# EAGLE schematic intech-senpai-camion-grue-complet (EAGLE 8.6.0)

## Sheet 1 of 3
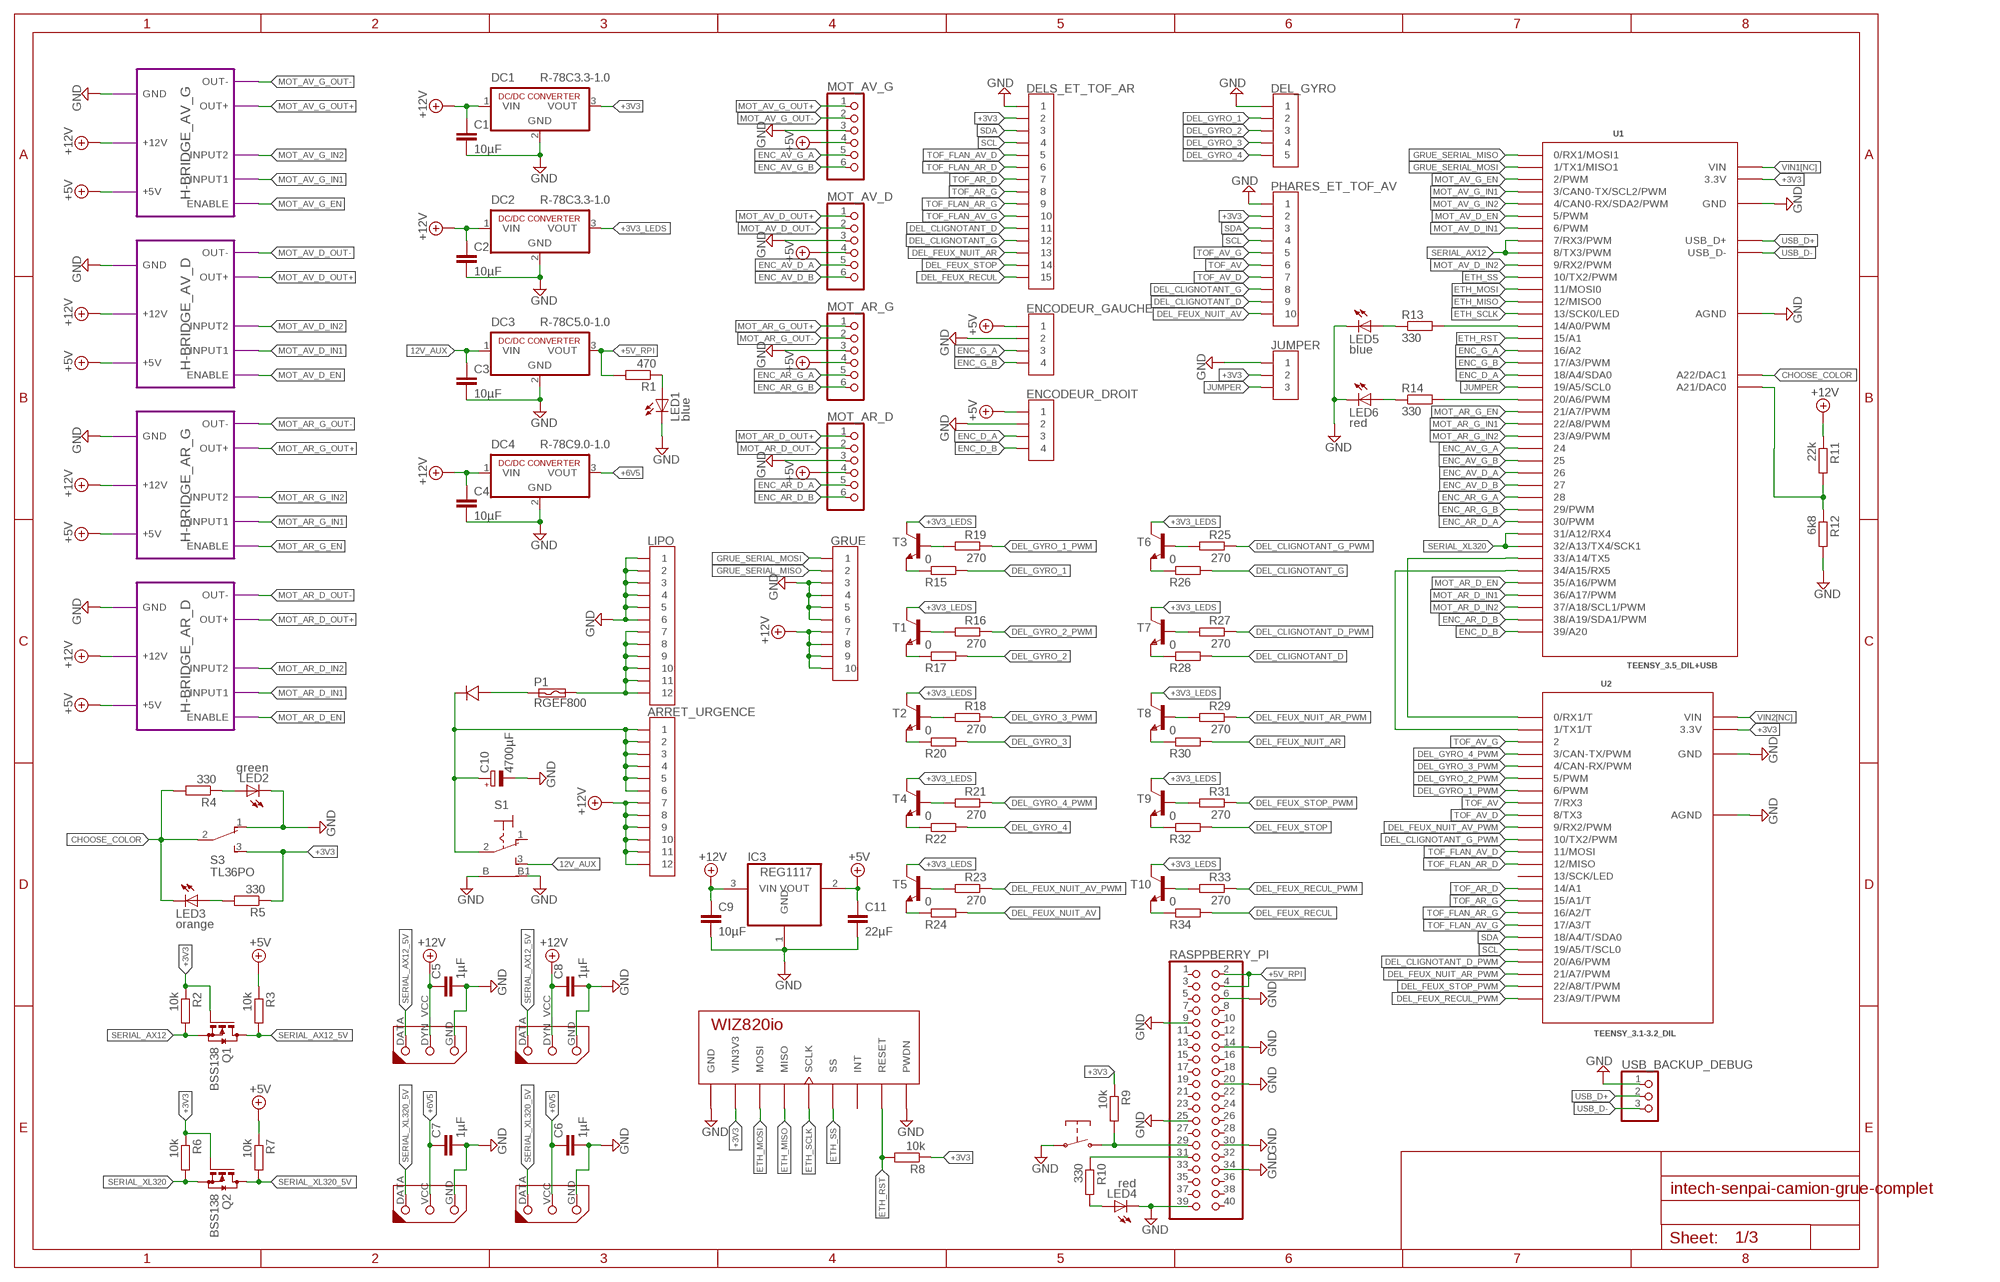
[diagram p0: schematic, sheet 1]

### Parts
ARRET_URGENCE  JST-12  [GH-12-V]
AX12_D  DYNAMIXEL-1X03AX  [DYNAMIXEL_AX_1X03]
AX12_G  DYNAMIXEL-1X03AX  [DYNAMIXEL_AX_1X03]
C1  10µF  C-EUC0805  [C0805]
C2  10µF  C-EUC0805  [C0805]
C3  10µF  C-EUC0805  [C0805]
C4  10µF  C-EUC0805  [C0805]
C5  1µF  C-EUC0805  [C0805]
C6  1µF  C-EUC0805  [C0805]
C7  1µF  C-EUC0805  [C0805]
C8  1µF  C-EUC0805  [C0805]
C9  10µF  C-EUC0805  [C0805]
C10  4700µF  CPOL-EUTT5D11L  [TT5D11L]
C11  22µF  C-EUC0805  [C0805]
D1  DIODE_S15P45  [TO-277A]
DC1  R-78C3.3-1.0  [SIP3]
DC2  R-78C3.3-1.0  [SIP3]
DC3  R-78C5.0-1.0  [SIP3]
DC4  R-78C9.0-1.0  [SIP3]
DEL_GYRO  JST-05  [GH-05-V]
DELS_ET_TOF_AR  JST-15  [GH-15-V]
ENCODEUR_DROIT  JST-04GH-V  [GH-04-V]
ENCODEUR_GAUCHE  JST-04GH-V  [GH-04-V]
GRUE  JST-10  [GH-10-V]
IC3  REG1117  [SOT223]
JUMPER  JST-03  [GH-03-V]
LED1  blue  LEDSMT1206  [1206]
LED2  green  LEDSMT1206  [1206]
LED3  orange  LEDSMT1206  [1206]
LED4  red  LEDSMT1206  [1206]
LED5  blue  LEDSMT1206  [1206]
LED6  red  LEDSMT1206  [1206]
LIPO  JST-12  [GH-12-V]
MOT_AR_D  PINHD-1X6  [1X06]
MOT_AR_G  PINHD-1X6  [1X06]
MOT_AV_D  PINHD-1X6  [1X06]
MOT_AV_G  PINHD-1X6  [1X06]
P1  RGEF800  [5MM]
PHARES_ET_TOF_AV  JST-10  [GH-10-V]
Q1  BSS138  BSS123  [SOT23]
Q2  BSS138  BSS123  [SOT23]
R1  470  R-EU_R0805  [R0805]
R2  10k  R-EU_R0805  [R0805]
R3  10k  R-EU_R0805  [R0805]
R4  330  R-EU_R0805  [R0805]
R5  330  R-EU_R0805  [R0805]
R6  10k  R-EU_R0805  [R0805]
R7  10k  R-EU_R0805  [R0805]
R8  10k  R-EU_R0805  [R0805]
R9  10k  R-EU_R0805  [R0805]
R10  330  R-EU_R0805  [R0805]
R11  22k  R-EU_R0805  [R0805]
R12  6k8  R-EU_R0805  [R0805]
R13  330  R-EU_R0805  [R0805]
R14  330  R-EU_R0805  [R0805]
R15  0  R-EU_R0805  [R0805]
R16  270  R-EU_R0805  [R0805]
R17  0  R-EU_R0805  [R0805]
R18  270  R-EU_R0805  [R0805]
R19  270  R-EU_R0805  [R0805]
R20  0  R-EU_R0805  [R0805]
R21  270  R-EU_R0805  [R0805]
R22  0  R-EU_R0805  [R0805]
R23  270  R-EU_R0805  [R0805]
R24  0  R-EU_R0805  [R0805]
R25  270  R-EU_R0805  [R0805]
R26  0  R-EU_R0805  [R0805]
R27  270  R-EU_R0805  [R0805]
R28  0  R-EU_R0805  [R0805]
R29  270  R-EU_R0805  [R0805]
R30  0  R-EU_R0805  [R0805]
R31  270  R-EU_R0805  [R0805]
R32  0  R-EU_R0805  [R0805]
R33  270  R-EU_R0805  [R0805]
R34  0  R-EU_R0805  [R0805]
RASPPBERRY_PI  PINHD-2X20/90  [2X20/90]
S1  SWITCH_LPV-1  [SWITCH_LPV-1]
S3  TL36PO  [TL3XPO]
T1  BC817-16-NPN-SOT23-BEC  [SOT23-BEC]
T2  BC817-16-NPN-SOT23-BEC  [SOT23-BEC]
T3  BC817-16-NPN-SOT23-BEC  [SOT23-BEC]
T4  BC817-16-NPN-SOT23-BEC  [SOT23-BEC]
T5  BC817-16-NPN-SOT23-BEC  [SOT23-BEC]
T6  BC817-16-NPN-SOT23-BEC  [SOT23-BEC]
T7  BC817-16-NPN-SOT23-BEC  [SOT23-BEC]
T8  BC817-16-NPN-SOT23-BEC  [SOT23-BEC]
T9  BC817-16-NPN-SOT23-BEC  [SOT23-BEC]
T10  BC817-16-NPN-SOT23-BEC  [SOT23-BEC]
U1  TEENSY_3.5_DIL+USB  [TEENSY_3.5_DIL+USB]
U2  TEENSY_3.1-3.2_DIL  [TEENSY_3.0-3.2&LC_DIL]
U$2  PUSH-BUTTON  [PUSH-BUTTON]
U$3  WIZ820IO  [WIZ820]
USB_BACKUP_DEBUG  PINHD-1X3  [1X03]
XL320_D  DYNAMIXEL-1X03XL  [DYNAMIXEL_XL_1X03]
XL320_G  DYNAMIXEL-1X03XL  [DYNAMIXEL_XL_1X03]

### Module instances
H-BRIDGE_AV_G = H-BRIDGE
H-BRIDGE_AV_D = H-BRIDGE
H-BRIDGE_AR_G = H-BRIDGE
H-BRIDGE_AR_D = H-BRIDGE

### Nets
12V_AUX: C3.1 DC3.1(VIN) S1.3(S)
+3V3: DC1.3(VOUT) DELS_ET_TOF_AR.2 JUMPER.2 PHARES_ET_TOF_AV.2 Q1.1(G) Q2.1(G) R2.1 R5.1 R6.1 R8.1 R9.1 S3.3(S) U1.3.3V U1.3.3V3(3.3V) U2.3.3V U$3.VIN1(VIN3V3) U$3.VIN2(VIN3V3)
+3V3_LEDS: DC2.3(VOUT) T1.C T2.C T3.C T4.C T5.C T6.C T7.C T8.C T9.C T10.C
+5V: C11.1 ENCODEUR_DROIT.1 ENCODEUR_GAUCHE.1 IC3.2(VOUT) MOT_AR_D.4 MOT_AR_G.4 MOT_AV_D.4 MOT_AV_G.4 R3.1 R7.1 ; port H-BRIDGE_AV_G.+5V H-BRIDGE_AV_D.+5V H-BRIDGE_AR_G.+5V H-BRIDGE_AR_D.+5V
+5V_RPI: DC3.3(VOUT) R1.2 RASPPBERRY_PI.2 RASPPBERRY_PI.4
+6V5: C6.1 C7.1 DC4.3(VOUT) XL320_D.VCC(DYN_VCC) XL320_G.VCC(DYN_VCC)
+12V: ARRET_URGENCE.7 ARRET_URGENCE.8 ARRET_URGENCE.9 ARRET_URGENCE.10 ARRET_URGENCE.11 ARRET_URGENCE.12 AX12_D.DYN_VCC AX12_G.DYN_VCC C1.1 C2.1 C4.1 C5.1 C8.1 C9.1 DC1.1(VIN) DC2.1(VIN) DC4.1(VIN) GRUE.7 GRUE.8 GRUE.9 GRUE.10 IC3.3(VIN) R11.1 ; port H-BRIDGE_AV_G.+12V H-BRIDGE_AV_D.+12V H-BRIDGE_AR_G.+12V H-BRIDGE_AR_D.+12V
CHOOSE_COLOR: LED3.C R4.2 S3.2(P) U1.A22(A22/DAC1)
DEL_CLIGNOTANT_D: DELS_ET_TOF_AR.11 PHARES_ET_TOF_AV.9 R28.2
DEL_CLIGNOTANT_D_PWM: R27.1 U2.20/A6(20/A6/PWM)
DEL_CLIGNOTANT_G: DELS_ET_TOF_AR.12 PHARES_ET_TOF_AV.8 R26.2
DEL_CLIGNOTANT_G_PWM: R25.1 U2.10(10/TX2/PWM)
DEL_FEUX_NUIT_AR: DELS_ET_TOF_AR.13 R30.2
DEL_FEUX_NUIT_AR_PWM: R29.1 U2.21/A7(21/A7/PWM)
DEL_FEUX_NUIT_AV: PHARES_ET_TOF_AV.10 R24.2
DEL_FEUX_NUIT_AV_PWM: R23.1 U2.9(9/RX2/PWM)
DEL_FEUX_RECUL: DELS_ET_TOF_AR.15 R34.2
DEL_FEUX_RECUL_PWM: R33.1 U2.23/A9(23/A9/T/PWM)
DEL_FEUX_STOP: DELS_ET_TOF_AR.14 R32.2
DEL_FEUX_STOP_PWM: R31.1 U2.22/A8(22/A8/T/PWM)
DEL_GYRO_1: DEL_GYRO.2 R15.2
DEL_GYRO_1_PWM: R19.1 U2.6(6/PWM)
DEL_GYRO_2: DEL_GYRO.3 R17.2
DEL_GYRO_2_PWM: R16.1 U2.5(5/PWM)
DEL_GYRO_3: DEL_GYRO.4 R20.2
DEL_GYRO_3_PWM: R18.1 U2.4(4/CAN-RX/PWM)
DEL_GYRO_4: DEL_GYRO.5 R22.2
DEL_GYRO_4_PWM: R21.1 U2.3(3/CAN-TX/PWM)
ENC_AR_D_A: MOT_AR_D.5 U1.30(30/PWM)
ENC_AR_D_B: MOT_AR_D.6 U1.38/A19(38/A19/SDA1/PWM)
ENC_AR_G_A: MOT_AR_G.5 U1.28
ENC_AR_G_B: MOT_AR_G.6 U1.29(29/PWM)
ENC_AV_D_A: MOT_AV_D.5 U1.26
ENC_AV_D_B: MOT_AV_D.6 U1.27
ENC_AV_G_A: MOT_AV_G.5 U1.24
ENC_AV_G_B: MOT_AV_G.6 U1.25
ENC_D_A: ENCODEUR_DROIT.3 U1.18/A4(18/A4/SDA0)
ENC_D_B: ENCODEUR_DROIT.4 U1.39/A20
ENC_G_A: ENCODEUR_GAUCHE.3 U1.16/A2
ENC_G_B: ENCODEUR_GAUCHE.4 U1.17/A3(17/A3/PWM)
ETH_MISO: U1.12(12/MISO0) U$3.MISO
ETH_MOSI: U1.11(11/MOSI0) U$3.MOSI
ETH_RST: R8.2 U1.15/A1 U$3.RESET
ETH_SCLK: U1.13(13/SCK0/LED) U$3.SCLK
ETH_SS: U1.10(10/TX2/PWM) U$3.SS
GND: AX12_D.GND AX12_G.GND C1.2 C2.2 C3.2 C4.2 C5.2 C6.2 C7.2 C8.2 C9.2 C10.- C11.2 DC1.2(GND) DC2.2(GND) DC3.2(GND) DC4.2(GND) DEL_GYRO.1 DELS_ET_TOF_AR.1 ENCODEUR_DROIT.2 ENCODEUR_GAUCHE.2 GRUE.3 GRUE.4 GRUE.5 GRUE.6 IC3.1(GND) JUMPER.1 LED1.C LED2.C LED4.C LED5.C LED6.C LIPO.1 LIPO.2 LIPO.3 LIPO.4 LIPO.5 LIPO.6 MOT_AR_D.3 MOT_AR_G.3 MOT_AV_D.3 MOT_AV_G.3 PHARES_ET_TOF_AV.1 R12.2 RASPPBERRY_PI.6 RASPPBERRY_PI.9 RASPPBERRY_PI.14 RASPPBERRY_PI.20 RASPPBERRY_PI.25 RASPPBERRY_PI.30 RASPPBERRY_PI.34 RASPPBERRY_PI.39 S1.B S1.B1 S3.1(O) U1.AGND U1.GND U1.GND1(GND) U2.AGND U2.GND U$2.1 U$2.2 U$3.GND1(GND) U$3.GND2(GND) U$3.GND3(GND) U$3.PWDN USB_BACKUP_DEBUG.1 XL320_D.GND XL320_G.GND ; port H-BRIDGE_AV_G.GND H-BRIDGE_AV_D.GND H-BRIDGE_AR_G.GND H-BRIDGE_AR_D.GND
GRUE_SERIAL_MISO: GRUE.2 U1.0(0/RX1/MOSI1)
GRUE_SERIAL_MOSI: GRUE.1 U1.1(1/TX1/MISO1)
JUMPER: JUMPER.3 U1.19/A5(19/A5/SCL0)
MOT_AR_D_EN: U1.35/A16(35/A16/PWM) ; port H-BRIDGE_AR_D.ENABLE
MOT_AR_D_IN1: U1.36/A17(36/A17/PWM) ; port H-BRIDGE_AR_D.INPUT1
MOT_AR_D_IN2: U1.37/A18(37/A18/SCL1/PWM) ; port H-BRIDGE_AR_D.INPUT2
MOT_AR_D_OUT+: MOT_AR_D.1 ; port H-BRIDGE_AR_D.OUT+
MOT_AR_D_OUT-: MOT_AR_D.2 ; port H-BRIDGE_AR_D.OUT-
MOT_AR_G_EN: U1.21/A7(21/A7/PWM) ; port H-BRIDGE_AR_G.ENABLE
MOT_AR_G_IN1: U1.22/A8(22/A8/PWM) ; port H-BRIDGE_AR_G.INPUT1
MOT_AR_G_IN2: U1.23/A9(23/A9/PWM) ; port H-BRIDGE_AR_G.INPUT2
MOT_AR_G_OUT+: MOT_AR_G.1 ; port H-BRIDGE_AR_G.OUT+
MOT_AR_G_OUT-: MOT_AR_G.2 ; port H-BRIDGE_AR_G.OUT-
MOT_AV_D_EN: U1.5(5/PWM) ; port H-BRIDGE_AV_D.ENABLE
MOT_AV_D_IN1: U1.6(6/PWM) ; port H-BRIDGE_AV_D.INPUT1
MOT_AV_D_IN2: U1.9(9/RX2/PWM) ; port H-BRIDGE_AV_D.INPUT2
MOT_AV_D_OUT+: MOT_AV_D.1 ; port H-BRIDGE_AV_D.OUT+
MOT_AV_D_OUT-: MOT_AV_D.2 ; port H-BRIDGE_AV_D.OUT-
MOT_AV_G_EN: U1.2(2/PWM) ; port H-BRIDGE_AV_G.ENABLE
MOT_AV_G_IN1: U1.3(3/CAN0-TX/SCL2/PWM) ; port H-BRIDGE_AV_G.INPUT1
MOT_AV_G_IN2: U1.4(4/CAN0-RX/SDA2/PWM) ; port H-BRIDGE_AV_G.INPUT2
MOT_AV_G_OUT+: MOT_AV_G.1 ; port H-BRIDGE_AV_G.OUT+
MOT_AV_G_OUT-: MOT_AV_G.2 ; port H-BRIDGE_AV_G.OUT-
N$1: LED1.A R1.1
N$2: R9.2 RASPPBERRY_PI.29 U$2.3 U$2.4
N$3: ARRET_URGENCE.1 ARRET_URGENCE.2 ARRET_URGENCE.3 ARRET_URGENCE.4 ARRET_URGENCE.5 ARRET_URGENCE.6 C10.+ D1.- S1.2(P)
N$4: D1.+1(+) D1.+2(+) P1.P$1
N$5: R10.1 RASPPBERRY_PI.31
N$6: U1.33/A14(33/A14/TX5) U2.0(0/RX1/T)
N$7: LED2.A R4.1
N$8: LED3.A R5.2
N$9: LIPO.7 LIPO.8 LIPO.9 LIPO.10 LIPO.11 LIPO.12 P1.P$2
N$10: U1.34/A15(34/A15/RX5) U2.1(1/TX1/T)
N$11: LED4.A R10.2
N$12: R11.2 R12.1 U1.A21(A21/DAC0)
N$13: LED6.A R14.1
N$14: LED5.A R13.1
N$15: R13.2 U1.14/A0(14/A0/PWM)
N$16: R14.2 U1.20/A6(20/A6/PWM)
N$17: R15.1 T3.E
N$18: R19.2 T3.B
N$21: R17.1 T1.E
N$22: R16.2 T1.B
N$25: R20.1 T2.E
N$26: R18.2 T2.B
N$29: R22.1 T4.E
N$30: R21.2 T4.B
N$33: R24.1 T5.E
N$34: R23.2 T5.B
N$37: R26.1 T6.E
N$38: R25.2 T6.B
N$41: R28.1 T7.E
N$42: R27.2 T7.B
N$45: R30.1 T8.E
N$46: R29.2 T8.B
N$49: R32.1 T9.E
N$50: R31.2 T9.B
N$53: R34.1 T10.E
N$54: R33.2 T10.B
SCL: DELS_ET_TOF_AR.4 PHARES_ET_TOF_AV.4 U2.19/A5(19/A5/T/SCL0)
SDA: DELS_ET_TOF_AR.3 PHARES_ET_TOF_AV.3 U2.18/A4(18/A4/T/SDA0)
SERIAL_AX12: Q1.2(S) R2.2 U1.7(7/RX3/PWM) U1.8(8/TX3/PWM)
SERIAL_AX12_5V: AX12_D.DATA AX12_G.DATA Q1.3(D) R3.2
SERIAL_XL320: Q2.2(S) R6.2 U1.31/A12(31/A12/RX4) U1.32/A13(32/A13/TX4/SCK1)
SERIAL_XL320_5V: Q2.3(D) R7.2 XL320_D.DATA XL320_G.DATA
TOF_AR_D: DELS_ET_TOF_AR.7 U2.14/A0(14/A1)
TOF_AR_G: DELS_ET_TOF_AR.8 U2.15/A1(15/A1/T)
TOF_AV: PHARES_ET_TOF_AV.6 U2.7(7/RX3)
TOF_AV_D: PHARES_ET_TOF_AV.7 U2.8(8/TX3)
TOF_AV_G: PHARES_ET_TOF_AV.5 U2.2
TOF_FLAN_AR_D: DELS_ET_TOF_AR.6 U2.12(12/MISO)
TOF_FLAN_AR_G: DELS_ET_TOF_AR.9 U2.16/A2(16/A2/T)
TOF_FLAN_AV_D: DELS_ET_TOF_AR.5 U2.11(11/MOSI)
TOF_FLAN_AV_G: DELS_ET_TOF_AR.10 U2.17/A3(17/A3/T)
USB_D+: U1.USBD+(USB_D+) USB_BACKUP_DEBUG.2
USB_D-: U1.USBD-(USB_D-) USB_BACKUP_DEBUG.3
VIN1[NC]: U1.VIN
VIN2[NC]: U2.VIN
Unconnected: RASPPBERRY_PI.1 RASPPBERRY_PI.3 RASPPBERRY_PI.5 RASPPBERRY_PI.7 RASPPBERRY_PI.8 RASPPBERRY_PI.10 RASPPBERRY_PI.11 RASPPBERRY_PI.12 RASPPBERRY_PI.13 RASPPBERRY_PI.15 RASPPBERRY_PI.16 RASPPBERRY_PI.17 RASPPBERRY_PI.18 RASPPBERRY_PI.19 RASPPBERRY_PI.21 RASPPBERRY_PI.22 RASPPBERRY_PI.23 RASPPBERRY_PI.24 RASPPBERRY_PI.26 RASPPBERRY_PI.27 RASPPBERRY_PI.28 RASPPBERRY_PI.32 RASPPBERRY_PI.33 RASPPBERRY_PI.35 RASPPBERRY_PI.36 RASPPBERRY_PI.37 RASPPBERRY_PI.38 RASPPBERRY_PI.40 S1.1(O) U2.13(13/SCK/LED) U$3.INT

## Sheet 2 of 3
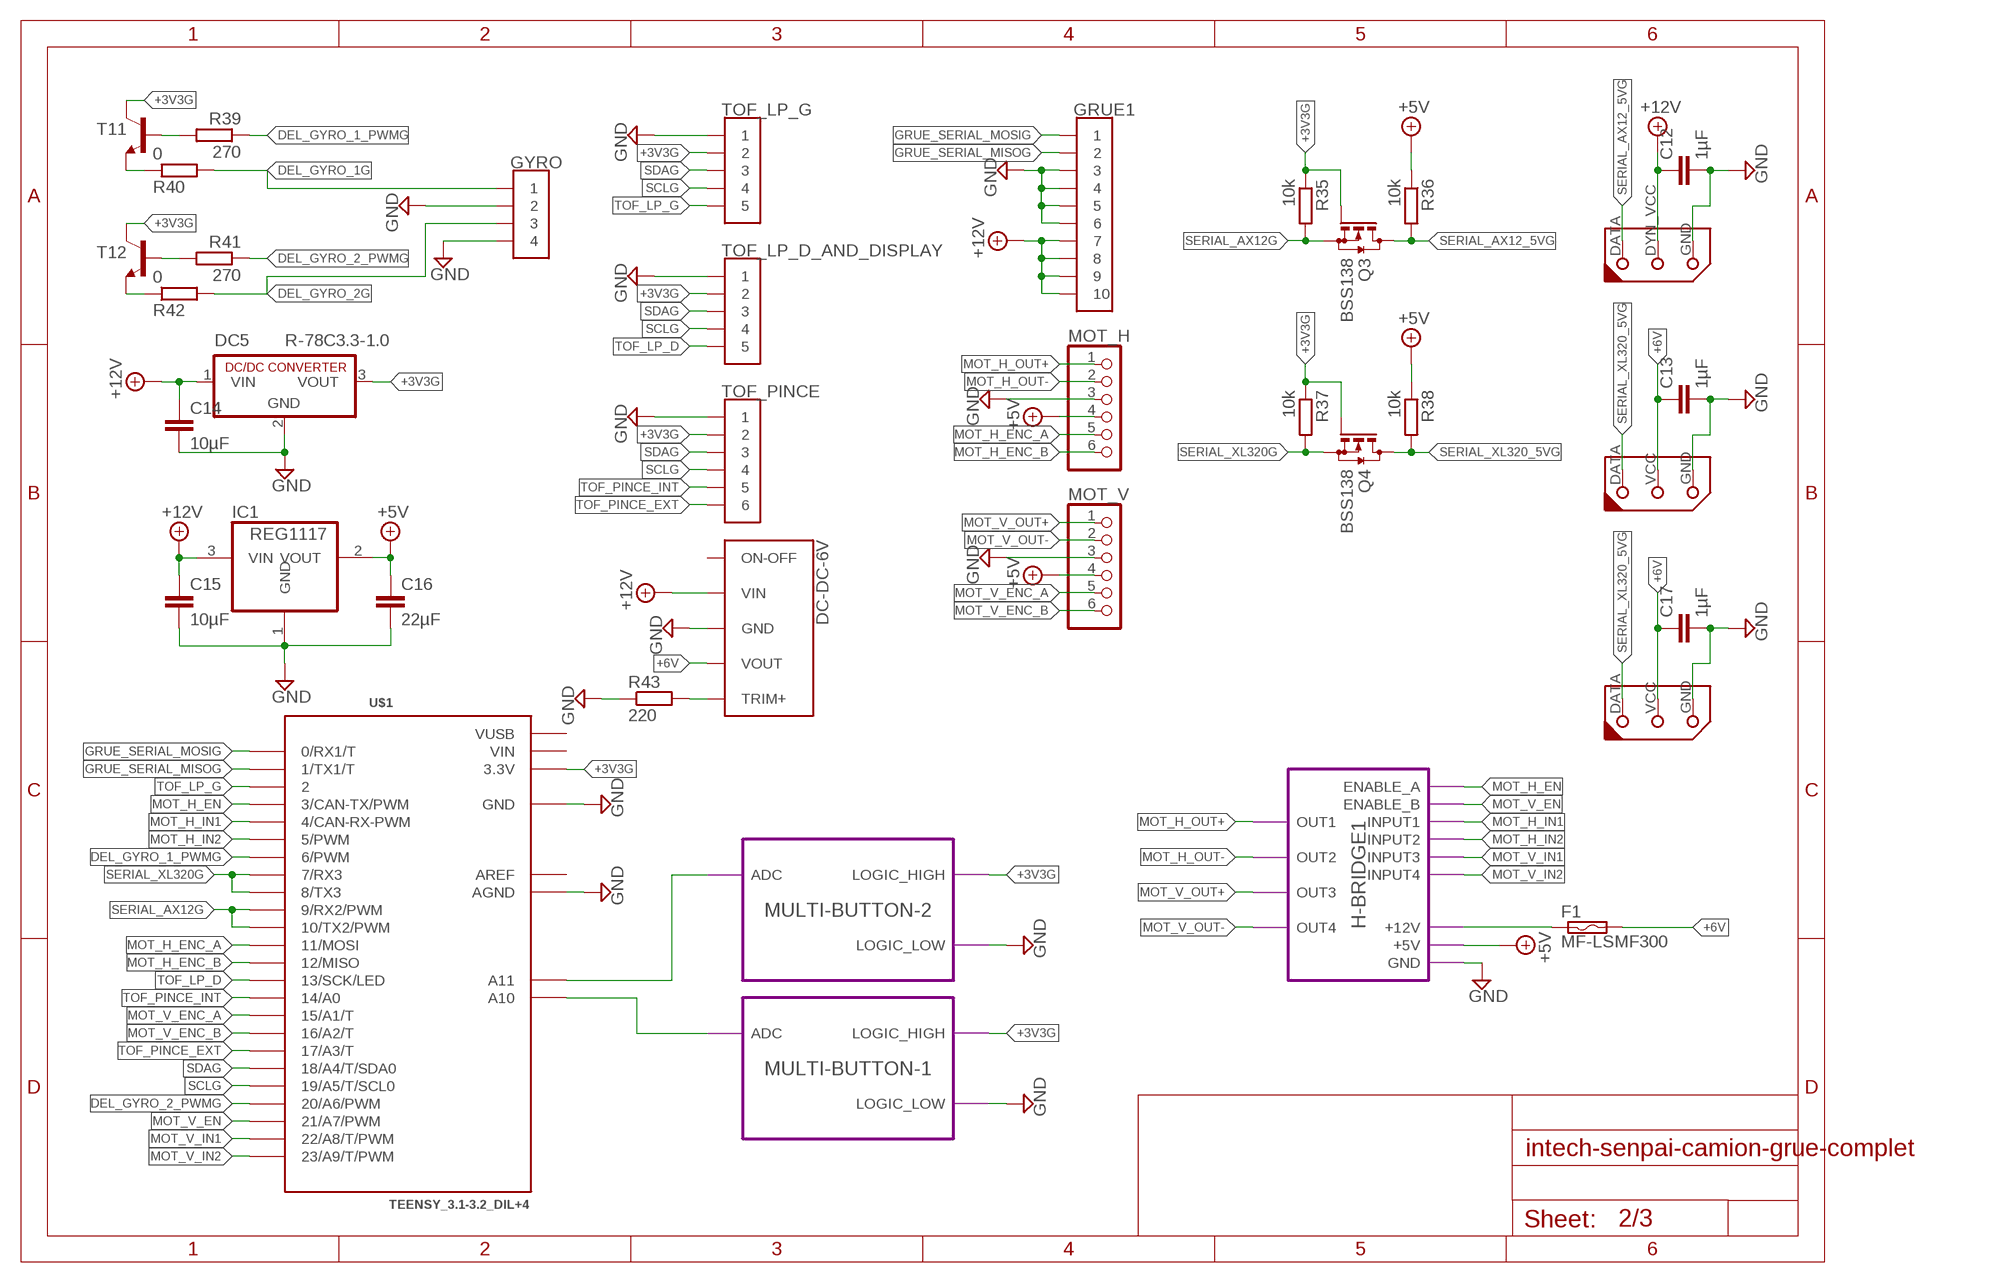
[diagram p1: schematic, sheet 2]

### Parts
AX12_G1  DYNAMIXEL-1X03AX  [DYNAMIXEL_AX_1X03]
C12  1µF  C-EUC0805  [C0805]
C13  1µF  C-EUC0805  [C0805]
C14  10µF  C-EUC0805  [C0805]
C15  10µF  C-EUC0805  [C0805]
C16  22µF  C-EUC0805  [C0805]
C17  1µF  C-EUC0805  [C0805]
DC5  R-78C3.3-1.0  [SIP3]
DC-DC-6V  DC-DC-CONVERTER  [DC-DC-CONVERTER]
F1  MF-LSMF300  [MF-LSMF300]
GRUE1  JST-10  [GH-10-V]
GYRO  JST-04GH-V  [GH-04-V]
IC1  REG1117  [SOT223]
MOT_H  PINHD-1X6  [1X06]
MOT_V  PINHD-1X6  [1X06]
Q3  BSS138  BSS123  [SOT23]
Q4  BSS138  BSS123  [SOT23]
R35  10k  R-EU_R0805  [R0805]
R36  10k  R-EU_R0805  [R0805]
R37  10k  R-EU_R0805  [R0805]
R38  10k  R-EU_R0805  [R0805]
R39  270  R-EU_R0805  [R0805]
R40  0  R-EU_R0805  [R0805]
R41  270  R-EU_R0805  [R0805]
R42  0  R-EU_R0805  [R0805]
R43  220  R-EU_R0805  [R0805]
T11  BC817-16-NPN-SOT23-BEC  [SOT23-BEC]
T12  BC817-16-NPN-SOT23-BEC  [SOT23-BEC]
TOF_LP_D_AND_DISPLAY  JST-05  [GH-05-V]
TOF_LP_G  JST-05  [GH-05-V]
TOF_PINCE  JST-06  [GH-06-V]
U$1  TEENSY_3.1-3.2_DIL+4  [TEENSY_3.0-3.2&LC_DIL+4]
XL320_G1  DYNAMIXEL-1X03XL  [DYNAMIXEL_XL_1X03]
XL320_G2  DYNAMIXEL-1X03XL  [DYNAMIXEL_XL_1X03]

### Module instances
MULTI-BUTTON-1 = MULTI-BUTTON-ON-ADC
MULTI-BUTTON-2 = MULTI-BUTTON-ON-ADC
H-BRIDGE1 = H-BRIDGE$A

### Nets
+3V3G: DC5.3(VOUT) Q3.1(G) Q4.1(G) R35.1 R37.1 T11.C T12.C TOF_LP_D_AND_DISPLAY.2 TOF_LP_G.2 TOF_PINCE.2 U$1.3.3V ; port MULTI-BUTTON-1.LOGIC_HIGH MULTI-BUTTON-2.LOGIC_HIGH
+5VG: C16.1 IC1.2(VOUT) MOT_H.4 MOT_V.4 R36.1 R38.1 ; port H-BRIDGE1.+5V ; supply symbol labelled +5V
+6V: C13.1 C17.1 DC-DC-6V.VOUT F1.2 XL320_G1.VCC(DYN_VCC) XL320_G2.VCC(DYN_VCC)
+12VG: AX12_G1.DYN_VCC C12.1 C14.1 C15.1 DC5.1(VIN) DC-DC-6V.VIN GRUE1.7 GRUE1.8 GRUE1.9 GRUE1.10 IC1.3(VIN) ; supply symbol labelled +12V
DEL_GYRO_1_PWMG: R39.1 U$1.6(6/PWM)
DEL_GYRO_1G: GYRO.1 R40.2
DEL_GYRO_2_PWMG: R41.1 U$1.20/A6(20/A6/PWM)
DEL_GYRO_2G: GYRO.3 R42.2
GNDG: AX12_G1.GND C12.2 C13.2 C14.2 C15.2 C16.2 C17.2 DC5.2(GND) DC-DC-6V.GND GRUE1.3 GRUE1.4 GRUE1.5 GRUE1.6 GYRO.2 GYRO.4 IC1.1(GND) MOT_H.3 MOT_V.3 R43.1 TOF_LP_D_AND_DISPLAY.1 TOF_LP_G.1 TOF_PINCE.1 U$1.AGND U$1.GND XL320_G1.GND XL320_G2.GND ; port MULTI-BUTTON-1.LOGIC_LOW MULTI-BUTTON-2.LOGIC_LOW H-BRIDGE1.GND ; supply symbol labelled GND
GRUE_SERIAL_MISOG: GRUE1.2 U$1.1(1/TX1/T)
GRUE_SERIAL_MOSIG: GRUE1.1 U$1.0(0/RX1/T)
MOT_H_EN: U$1.3(3/CAN-TX/PWM) ; port H-BRIDGE1.ENABLE_A
MOT_H_ENC_A: MOT_H.5 U$1.11(11/MOSI)
MOT_H_ENC_B: MOT_H.6 U$1.12(12/MISO)
MOT_H_IN1: U$1.4(4/CAN-RX-PWM) ; port H-BRIDGE1.INPUT1
MOT_H_IN2: U$1.5(5/PWM) ; port H-BRIDGE1.INPUT2
MOT_H_OUT+: MOT_H.1 ; port H-BRIDGE1.OUT1
MOT_H_OUT-: MOT_H.2 ; port H-BRIDGE1.OUT2
MOT_V_EN: U$1.21/A7(21/A7/PWM) ; port H-BRIDGE1.ENABLE_B
MOT_V_ENC_A: MOT_V.5 U$1.15/A1(15/A1/T)
MOT_V_ENC_B: MOT_V.6 U$1.16/A2(16/A2/T)
MOT_V_IN1: U$1.22/A8(22/A8/T/PWM) ; port H-BRIDGE1.INPUT3
MOT_V_IN2: U$1.23/A9(23/A9/T/PWM) ; port H-BRIDGE1.INPUT4
MOT_V_OUT+: MOT_V.1 ; port H-BRIDGE1.OUT3
MOT_V_OUT-: MOT_V.2 ; port H-BRIDGE1.OUT4
N$19: R40.1 T11.E
N$20: R39.2 T11.B
N$23: R42.1 T12.E
N$24: R41.2 T12.B
N$27: DC-DC-6V.TRIM+ R43.2
N$28: U$1.A10 ; port MULTI-BUTTON-1.ADC
N$31: U$1.A11 ; port MULTI-BUTTON-2.ADC
N$32: F1.1 ; port H-BRIDGE1.+12V
SCLG: TOF_LP_D_AND_DISPLAY.4 TOF_LP_G.4 TOF_PINCE.4 U$1.19/A5(19/A5/T/SCL0)
SDAG: TOF_LP_D_AND_DISPLAY.3 TOF_LP_G.3 TOF_PINCE.3 U$1.18/A4(18/A4/T/SDA0)
SERIAL_AX12_5VG: AX12_G1.DATA Q3.3(D) R36.2
SERIAL_AX12G: Q3.2(S) R35.2 U$1.9(9/RX2/PWM) U$1.10(10/TX2/PWM)
SERIAL_XL320_5VG: Q4.3(D) R38.2 XL320_G1.DATA XL320_G2.DATA
SERIAL_XL320G: Q4.2(S) R37.2 U$1.7(7/RX3) U$1.8(8/TX3)
TOF_LP_D: TOF_LP_D_AND_DISPLAY.5 U$1.13(13/SCK/LED)
TOF_LP_G: TOF_LP_G.5 U$1.2
TOF_PINCE_EXT: TOF_PINCE.6 U$1.17/A3(17/A3/T)
TOF_PINCE_INT: TOF_PINCE.5 U$1.14/A0
Unconnected: DC-DC-6V.ON-OFF

## Sheet 3 of 3
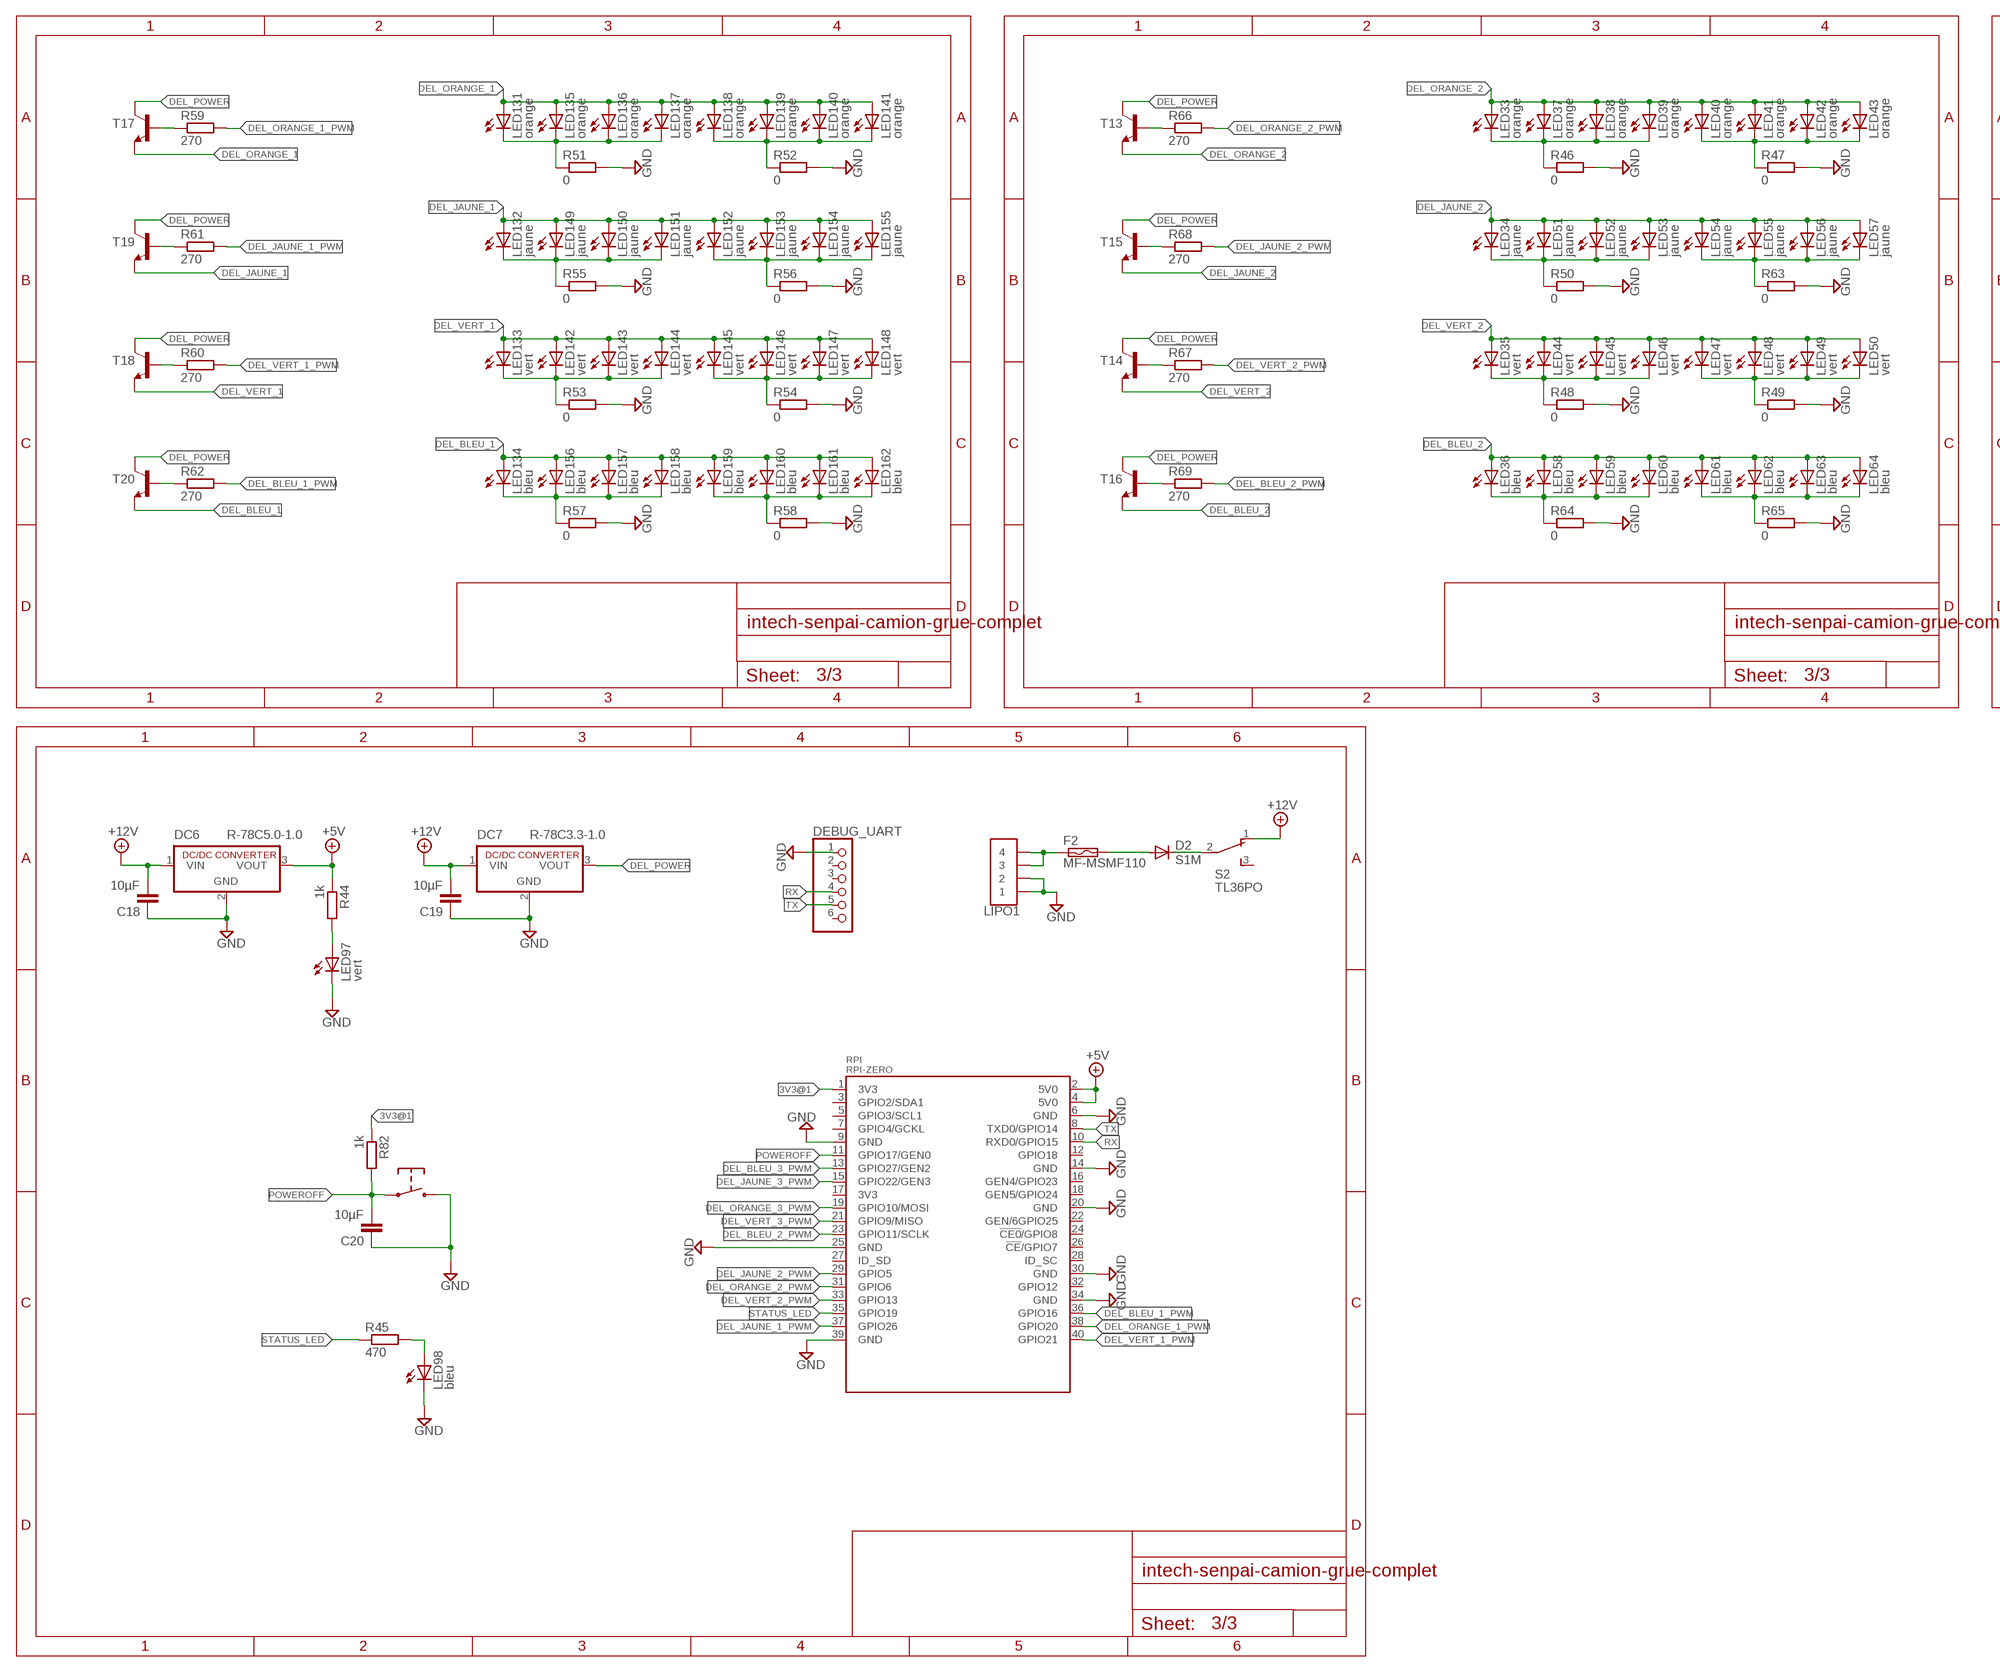
[diagram p2: schematic, sheet 3, part 1 of 2]
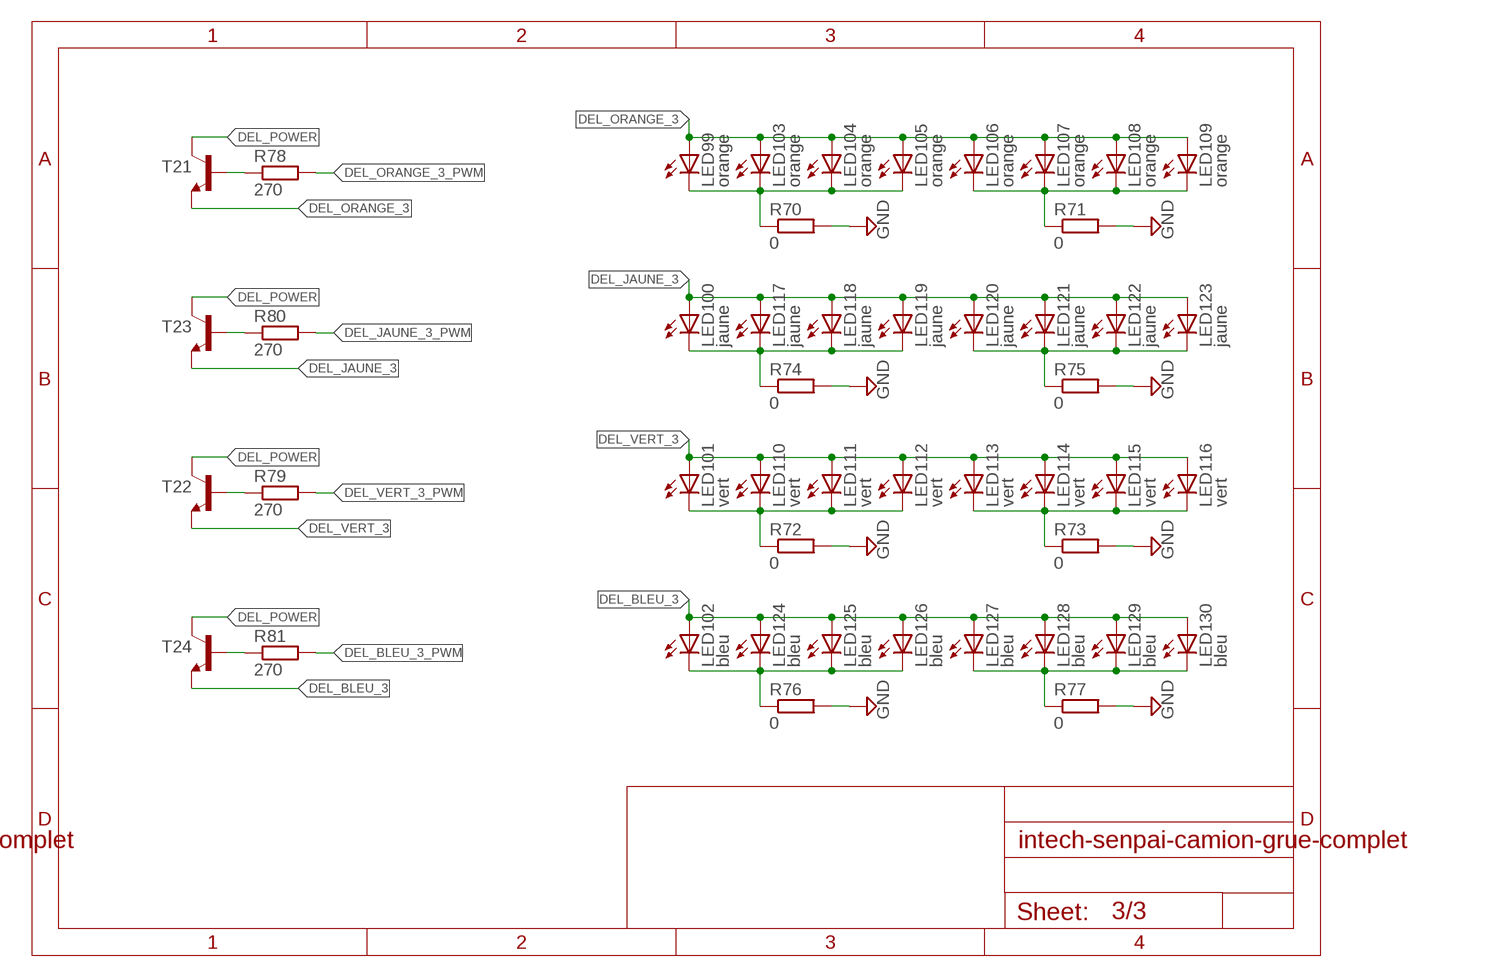
[diagram p3: schematic, sheet 3, part 2 of 2]

### Parts
C18  10µF  C-EUC0805  [C0805]
C19  10µF  C-EUC0805  [C0805]
C20  10µF  C-EUC0805  [C0805]
D2  S1M  [SMA]
DC6  R-78C5.0-1.0  [SIP3]
DC7  R-78C3.3-1.0  [SIP3]
DEBUG_UART  PINHD-1X6  [1X06]
F2  MF-MSMF110  [MF-MSMF110]
LED33  orange  LED5MM  [LED5MM]
LED34  jaune  LED5MM  [LED5MM]
LED35  vert  LED5MM  [LED5MM]
LED36  bleu  LED5MM  [LED5MM]
LED37  orange  LED5MM  [LED5MM]
LED38  orange  LED5MM  [LED5MM]
LED39  orange  LED5MM  [LED5MM]
LED40  orange  LED5MM  [LED5MM]
LED41  orange  LED5MM  [LED5MM]
LED42  orange  LED5MM  [LED5MM]
LED43  orange  LED5MM  [LED5MM]
LED44  vert  LED5MM  [LED5MM]
LED45  vert  LED5MM  [LED5MM]
LED46  vert  LED5MM  [LED5MM]
LED47  vert  LED5MM  [LED5MM]
LED48  vert  LED5MM  [LED5MM]
LED49  vert  LED5MM  [LED5MM]
LED50  vert  LED5MM  [LED5MM]
LED51  jaune  LED5MM  [LED5MM]
LED52  jaune  LED5MM  [LED5MM]
LED53  jaune  LED5MM  [LED5MM]
LED54  jaune  LED5MM  [LED5MM]
LED55  jaune  LED5MM  [LED5MM]
LED56  jaune  LED5MM  [LED5MM]
LED57  jaune  LED5MM  [LED5MM]
LED58  bleu  LED5MM  [LED5MM]
LED59  bleu  LED5MM  [LED5MM]
LED60  bleu  LED5MM  [LED5MM]
LED61  bleu  LED5MM  [LED5MM]
LED62  bleu  LED5MM  [LED5MM]
LED63  bleu  LED5MM  [LED5MM]
LED64  bleu  LED5MM  [LED5MM]
LED97  vert  LED5MM  [LED5MM]
LED98  bleu  LED5MM  [LED5MM]
LED99  orange  LED5MM  [LED5MM]
LED100  jaune  LED5MM  [LED5MM]
LED101  vert  LED5MM  [LED5MM]
LED102  bleu  LED5MM  [LED5MM]
LED103  orange  LED5MM  [LED5MM]
LED104  orange  LED5MM  [LED5MM]
LED105  orange  LED5MM  [LED5MM]
LED106  orange  LED5MM  [LED5MM]
LED107  orange  LED5MM  [LED5MM]
LED108  orange  LED5MM  [LED5MM]
LED109  orange  LED5MM  [LED5MM]
LED110  vert  LED5MM  [LED5MM]
LED111  vert  LED5MM  [LED5MM]
LED112  vert  LED5MM  [LED5MM]
LED113  vert  LED5MM  [LED5MM]
LED114  vert  LED5MM  [LED5MM]
LED115  vert  LED5MM  [LED5MM]
LED116  vert  LED5MM  [LED5MM]
LED117  jaune  LED5MM  [LED5MM]
LED118  jaune  LED5MM  [LED5MM]
LED119  jaune  LED5MM  [LED5MM]
LED120  jaune  LED5MM  [LED5MM]
LED121  jaune  LED5MM  [LED5MM]
LED122  jaune  LED5MM  [LED5MM]
LED123  jaune  LED5MM  [LED5MM]
LED124  bleu  LED5MM  [LED5MM]
LED125  bleu  LED5MM  [LED5MM]
LED126  bleu  LED5MM  [LED5MM]
LED127  bleu  LED5MM  [LED5MM]
LED128  bleu  LED5MM  [LED5MM]
LED129  bleu  LED5MM  [LED5MM]
LED130  bleu  LED5MM  [LED5MM]
LED131  orange  LED5MM  [LED5MM]
LED132  jaune  LED5MM  [LED5MM]
LED133  vert  LED5MM  [LED5MM]
LED134  bleu  LED5MM  [LED5MM]
LED135  orange  LED5MM  [LED5MM]
LED136  orange  LED5MM  [LED5MM]
LED137  orange  LED5MM  [LED5MM]
LED138  orange  LED5MM  [LED5MM]
LED139  orange  LED5MM  [LED5MM]
LED140  orange  LED5MM  [LED5MM]
LED141  orange  LED5MM  [LED5MM]
LED142  vert  LED5MM  [LED5MM]
LED143  vert  LED5MM  [LED5MM]
LED144  vert  LED5MM  [LED5MM]
LED145  vert  LED5MM  [LED5MM]
LED146  vert  LED5MM  [LED5MM]
LED147  vert  LED5MM  [LED5MM]
LED148  vert  LED5MM  [LED5MM]
LED149  jaune  LED5MM  [LED5MM]
LED150  jaune  LED5MM  [LED5MM]
LED151  jaune  LED5MM  [LED5MM]
LED152  jaune  LED5MM  [LED5MM]
LED153  jaune  LED5MM  [LED5MM]
LED154  jaune  LED5MM  [LED5MM]
LED155  jaune  LED5MM  [LED5MM]
LED156  bleu  LED5MM  [LED5MM]
LED157  bleu  LED5MM  [LED5MM]
LED158  bleu  LED5MM  [LED5MM]
LED159  bleu  LED5MM  [LED5MM]
LED160  bleu  LED5MM  [LED5MM]
LED161  bleu  LED5MM  [LED5MM]
LED162  bleu  LED5MM  [LED5MM]
LIPO1  JST-04GH-V  [GH-04-V]
R44  1k  R-EU_R0805  [R0805]
R45  470  R-EU_R0805  [R0805]
R46  0  R-EU_R0805  [R0805]
R47  0  R-EU_R0805  [R0805]
R48  0  R-EU_R0805  [R0805]
R49  0  R-EU_R0805  [R0805]
R50  0  R-EU_R0805  [R0805]
R51  0  R-EU_R0805  [R0805]
R52  0  R-EU_R0805  [R0805]
R53  0  R-EU_R0805  [R0805]
R54  0  R-EU_R0805  [R0805]
R55  0  R-EU_R0805  [R0805]
R56  0  R-EU_R0805  [R0805]
R57  0  R-EU_R0805  [R0805]
R58  0  R-EU_R0805  [R0805]
R59  270  R-EU_R0805  [R0805]
R60  270  R-EU_R0805  [R0805]
R61  270  R-EU_R0805  [R0805]
R62  270  R-EU_R0805  [R0805]
R63  0  R-EU_R0805  [R0805]
R64  0  R-EU_R0805  [R0805]
R65  0  R-EU_R0805  [R0805]
R66  270  R-EU_R0805  [R0805]
R67  270  R-EU_R0805  [R0805]
R68  270  R-EU_R0805  [R0805]
R69  270  R-EU_R0805  [R0805]
R70  0  R-EU_R0805  [R0805]
R71  0  R-EU_R0805  [R0805]
R72  0  R-EU_R0805  [R0805]
R73  0  R-EU_R0805  [R0805]
R74  0  R-EU_R0805  [R0805]
R75  0  R-EU_R0805  [R0805]
R76  0  R-EU_R0805  [R0805]
R77  0  R-EU_R0805  [R0805]
R78  270  R-EU_R0805  [R0805]
R79  270  R-EU_R0805  [R0805]
R80  270  R-EU_R0805  [R0805]
R81  270  R-EU_R0805  [R0805]
R82  1k  R-EU_R0805  [R0805]
RPI  RPI-ZERO  [RASPBERRYPI_BASTELSTUBE_V13_RASPI_BOARD_B+_FULL]
S2  TL36PO  [TL3XPO]
T13  BC817-16-NPN-SOT23-BEC  [SOT23-BEC]
T14  BC817-16-NPN-SOT23-BEC  [SOT23-BEC]
T15  BC817-16-NPN-SOT23-BEC  [SOT23-BEC]
T16  BC817-16-NPN-SOT23-BEC  [SOT23-BEC]
T17  BC817-16-NPN-SOT23-BEC  [SOT23-BEC]
T18  BC817-16-NPN-SOT23-BEC  [SOT23-BEC]
T19  BC817-16-NPN-SOT23-BEC  [SOT23-BEC]
T20  BC817-16-NPN-SOT23-BEC  [SOT23-BEC]
T21  BC817-16-NPN-SOT23-BEC  [SOT23-BEC]
T22  BC817-16-NPN-SOT23-BEC  [SOT23-BEC]
T23  BC817-16-NPN-SOT23-BEC  [SOT23-BEC]
T24  BC817-16-NPN-SOT23-BEC  [SOT23-BEC]
U$4  PUSH-BUTTON  [PUSH-BUTTON]

### Nets
3V3@1: R82.1 RPI.1(3V3)
+5VB: DC6.3(VOUT) R44.1 RPI.2(5V0) RPI.4(5V0) ; supply symbol labelled +5V
+12VB: C18.2 C19.2 DC6.1(VIN) DC7.1(VIN) S2.1(O) ; supply symbol labelled +12V
DEL_BLEU_1: LED134.A LED156.A LED157.A LED158.A LED159.A LED160.A LED161.A LED162.A T20.E
DEL_BLEU_1_PWM: R62.2 RPI.36(GPIO16)
DEL_BLEU_2: LED36.A LED58.A LED59.A LED60.A LED61.A LED62.A LED63.A LED64.A T16.E
DEL_BLEU_2_PWM: R69.2 RPI.23(GPIO11/SCLK)
DEL_BLEU_3: LED102.A LED124.A LED125.A LED126.A LED127.A LED128.A LED129.A LED130.A T24.E
DEL_BLEU_3_PWM: R81.2 RPI.13(GPIO27/GEN2)
DEL_JAUNE_1: LED132.A LED149.A LED150.A LED151.A LED152.A LED153.A LED154.A LED155.A T19.E
DEL_JAUNE_1_PWM: R61.2 RPI.37(GPIO26)
DEL_JAUNE_2: LED34.A LED51.A LED52.A LED53.A LED54.A LED55.A LED56.A LED57.A T15.E
DEL_JAUNE_2_PWM: R68.2 RPI.29(GPIO5)
DEL_JAUNE_3: LED100.A LED117.A LED118.A LED119.A LED120.A LED121.A LED122.A LED123.A T23.E
DEL_JAUNE_3_PWM: R80.2 RPI.15(GPIO22/GEN3)
DEL_ORANGE_1: LED131.A LED135.A LED136.A LED137.A LED138.A LED139.A LED140.A LED141.A T17.E
DEL_ORANGE_1_PWM: R59.2 RPI.38(GPIO20)
DEL_ORANGE_2: LED33.A LED37.A LED38.A LED39.A LED40.A LED41.A LED42.A LED43.A T13.E
DEL_ORANGE_2_PWM: R66.2 RPI.31(GPIO6)
DEL_ORANGE_3: LED99.A LED103.A LED104.A LED105.A LED106.A LED107.A LED108.A LED109.A T21.E
DEL_ORANGE_3_PWM: R78.2 RPI.19(GPIO10/MOSI)
DEL_POWER: DC7.3(VOUT) T13.C T14.C T15.C T16.C T17.C T18.C T19.C T20.C T21.C T22.C T23.C T24.C
DEL_VERT_1: LED133.A LED142.A LED143.A LED144.A LED145.A LED146.A LED147.A LED148.A T18.E
DEL_VERT_1_PWM: R60.2 RPI.40(GPIO21)
DEL_VERT_2: LED35.A LED44.A LED45.A LED46.A LED47.A LED48.A LED49.A LED50.A T14.E
DEL_VERT_2_PWM: R67.2 RPI.33(GPIO13)
DEL_VERT_3: LED101.A LED110.A LED111.A LED112.A LED113.A LED114.A LED115.A LED116.A T22.E
DEL_VERT_3_PWM: R79.2 RPI.21(GPIO9/MISO)
GNDB: C18.1 C19.1 C20.1 DC6.2(GND) DC7.2(GND) DEBUG_UART.1 LED97.K(C) LED98.K(C) LIPO1.1 LIPO1.2 R46.2 R47.2 R48.2 R49.2 R50.2 R51.2 R52.2 R53.2 R54.2 R55.2 R56.2 R57.2 R58.2 R63.2 R64.2 R65.2 R70.2 R71.2 R72.2 R73.2 R74.2 R75.2 R76.2 R77.2 RPI.6(GND) RPI.9(GND) RPI.14(GND) RPI.20(GND) RPI.25(GND) RPI.30(GND) RPI.34(GND) RPI.39(GND) U$4.3 U$4.4 ; supply symbol labelled GND
N$35: F2.1 LIPO1.3 LIPO1.4
N$36: D2.A F2.2
N$39: D2.C S2.2(P)
N$40: LED97.A R44.2
N$43: LED98.A R45.2
N$44: LED33.K(C) LED37.K(C) LED38.K(C) LED39.K(C) R46.1
N$47: LED40.K(C) LED41.K(C) LED42.K(C) LED43.K(C) R47.1
N$48: LED35.K(C) LED44.K(C) LED45.K(C) LED46.K(C) R48.1
N$51: LED47.K(C) LED48.K(C) LED49.K(C) LED50.K(C) R49.1
N$52: LED34.K(C) LED51.K(C) LED52.K(C) LED53.K(C) R50.1
N$55: LED131.K(C) LED135.K(C) LED136.K(C) LED137.K(C) R51.1
N$56: LED138.K(C) LED139.K(C) LED140.K(C) LED141.K(C) R52.1
N$57: LED133.K(C) LED142.K(C) LED143.K(C) LED144.K(C) R53.1
N$58: LED145.K(C) LED146.K(C) LED147.K(C) LED148.K(C) R54.1
N$59: LED132.K(C) LED149.K(C) LED150.K(C) LED151.K(C) R55.1
N$60: LED152.K(C) LED153.K(C) LED154.K(C) LED155.K(C) R56.1
N$61: LED134.K(C) LED156.K(C) LED157.K(C) LED158.K(C) R57.1
N$62: LED159.K(C) LED160.K(C) LED161.K(C) LED162.K(C) R58.1
N$63: R59.1 T17.B
N$64: R60.1 T18.B
N$65: R61.1 T19.B
N$66: R62.1 T20.B
N$67: LED54.K(C) LED55.K(C) LED56.K(C) LED57.K(C) R63.1
N$68: LED36.K(C) LED58.K(C) LED59.K(C) LED60.K(C) R64.1
N$69: LED61.K(C) LED62.K(C) LED63.K(C) LED64.K(C) R65.1
N$70: R66.1 T13.B
N$71: R67.1 T14.B
N$72: R68.1 T15.B
N$73: R69.1 T16.B
N$74: LED99.K(C) LED103.K(C) LED104.K(C) LED105.K(C) R70.1
N$75: LED106.K(C) LED107.K(C) LED108.K(C) LED109.K(C) R71.1
N$76: LED101.K(C) LED110.K(C) LED111.K(C) LED112.K(C) R72.1
N$77: LED113.K(C) LED114.K(C) LED115.K(C) LED116.K(C) R73.1
N$78: LED100.K(C) LED117.K(C) LED118.K(C) LED119.K(C) R74.1
N$79: LED120.K(C) LED121.K(C) LED122.K(C) LED123.K(C) R75.1
N$80: LED102.K(C) LED124.K(C) LED125.K(C) LED126.K(C) R76.1
N$81: LED127.K(C) LED128.K(C) LED129.K(C) LED130.K(C) R77.1
N$82: R78.1 T21.B
N$83: R79.1 T22.B
N$84: R80.1 T23.B
N$85: R81.1 T24.B
POWEROFF: C20.2 R82.2 RPI.11(GPIO17/GEN0) U$4.1 U$4.2
RX: DEBUG_UART.4 RPI.10(RXD0/GPIO15)
STATUS_LED: R45.1 RPI.35(GPIO19)
TX: DEBUG_UART.5 RPI.8(TXD0/GPIO14)
Unconnected: DEBUG_UART.2 DEBUG_UART.3 DEBUG_UART.6 RPI.3(GPIO2/SDA1) RPI.5(GPIO3/SCL1) RPI.7(GPIO4/GCKL) RPI.12(GPIO18) RPI.16(GEN4/GPIO23) RPI.17(3V3) RPI.18(GEN5/GPIO24) RPI.22(GEN/6GPIO25) RPI.24(!CE0!/GPIO8) RPI.26(!CE!/GPIO7) RPI.27(ID_SD) RPI.28(ID_SC) RPI.32(GPIO12) S2.3(S)

## Power pins joined to a net without a drawn wire
AREF: U$1.AREF
VIN: U$1.VIN
VUSB: U$1.VUSB

## Library data of the parts
ARRET_URGENCE LIPO = con-jst:JST-12
AX12_D AX12_G AX12_G1 XL320_D XL320_G XL320_G1 XL320_G2 = 1NTech_pinhead:DYNAMIXEL-1X03
C1-C9 C11-C20 = resistor:C-EU: CAPACITOR, European symbol
C10 = 1NTech_RLCD:CPOL-EU: POLARIZED CAPACITOR, European symbol
D1 = diode_schottky:DIODE_S15P45
D2 = diode:S1M; RS: 872-2874
DC1-DC7 = dc-dc-converter:R-78C*-1.0: INNOLINE DC/DC-Converter 1.0 AMP SIP3 Single Output Source: Data sheet <http://www.mikrocontroller.net/attachment/150645/157764-da-01-en-DC_DC_WANDLER_R_78C5_0_1_0.pdf>
DC-DC-6V = dc-dc-converter-6v:DC-DC-CONVERTER; RS: 715-8575
DEBUG_UART MOT_AR_D MOT_AR_G MOT_AV_D MOT_AV_G MOT_H MOT_V = pinhead:PINHD-1X6: PIN HEADER
DEL_GYRO TOF_LP_D_AND_DISPLAY TOF_LP_G = con-jst:JST-05
DELS_ET_TOF_AR = con-jst:JST-15
ENCODEUR_DROIT ENCODEUR_GAUCHE GYRO LIPO1 = con-jst:JST-04
F1 = polyswitch:MF-LSMF300: PolySwitch (TM) Resettable Device Source: Data sheet <http://www.farnell.com/datasheets/13482.pdf>; RS: 817-1652
F2 = polyswitch:MF-MSMF110; RS: 647-8207
GRUE GRUE1 PHARES_ET_TOF_AV = con-jst:JST-10
IC1 IC3 = burr-brown:REG1117: 800mA and 1A Low Dropout (LDO) Positive Regulator 1.8V, 2.5V, 2.85V, 3.3V, 5V, and Adj; MPN: REG1117; OC_FARNELL: 1097566; OC_NEWARK: 14P6981; RS: 885-5432
JUMPER = con-jst:JST-03
LED1-LED6 LED33-LED64 LED97-LED162 = led:LED: LED OSRAM: - CHIPLED LG R971, LG N971, LY N971, LG Q971, LY Q971, LO R971, LY R971 LH N974, LH R974 LS Q976, LO Q976, LY Q976 LO Q996 - Hyper CHIPLED LW Q18S LB Q993, LB Q99A, LB R99A - SideLED LS A670, LO A670, LY A670, LG A670, LP A670 LB A673, LV A673, LT A673, LW A673 LH A674 LY A675 LS A676, LA A676, LO A676, LY A676, LW A676 LS A679, LY A679, LG A679 - Hyper Micro SIDELED® LS Y876, LA Y876, LO Y876, LY Y876 LT Y87S - SmartLED LW L88C, LW L88S LB L89C, LB L89S, LG L890 LS L89K, LO L89K, LY L89K LS L896, LA L896, LO L896, LY L896 - TOPLED LS T670, LO T670, LY T670, LG T670, LP T670 LSG T670, LSP T670, LSY T670, LOP T670, LYG T670 LG T671, LOG T671, LSG T671 LB T673, LV T673, LT T673, LW T673 LH T674 LS T676, LA T676, LO T676, LY T676, LB T676, LH T676, LSB T676, LW T676 LB T67C, LV T67C, LT T67C, LS T67K, LO T67K, LY T67K, LW E67C LS E67B, LA E67B, LO E67B, LY E67B, LB E67C, LV E67C, LT E67C LW T67C LS T679, LY T679, LG T679 LS T770, LO T770, LY T770, LG T770, LP T770 LB T773, LV T773, LT T773, LW T773 LH T774 LS E675, LA E675, LY E675, LS T675 LS T776, LA T776, LO T776, LY T776, LB T776 LHGB T686 LT T68C, LB T68C - Hyper Mini TOPLED® LB M676 - Mini TOPLED Santana® LG M470 LS M47K, LO M47K, LY M47K Source: http://www.osram.convergy.de LUXEON: - LUMILED® LXK2-PW12-R00, LXK2-PW12-S00, LXK2-PW14-U00, LXK2-PW14-V00 LXK2-PM12-R00, LXK2-PM12-S00, LXK2-PM14-U00 LXK2-PE12-Q00, LXK2-PE12-R00, LXK2-PE12-S00, LXK2-PE14-T00, LXK2-PE14-U00 LXK2-PB12-K00, LXK2-PB12-L00, LXK2-PB12-M00, LXK2-PB14-N00, LXK2-PB14-P00, LXK2-PB14-Q00 LXK2-PR12-L00, LXK2-PR12-M00, LXK2-PR14-Q00, LXK2-PR14-R00 LXK2-PD12-Q00, LXK2-PD12-R00, LXK2-PD12-S00 LXK2-PH12-R00, LXK2-PH12-S00 LXK2-PL12-P00, LXK2-PL12-Q00, LXK2-PL12-R00 Source: www.luxeon.com KINGBRIGHT: KA-3528ASYC Source: www.kingbright.com
P1 = polyswitch:RGEF800; RS: 517-6966
Q1-Q4 = transistor-small-signal:BSS123: N-CHANNEL MOS FET
R1-R82 = resistor:R-EU_: RESISTOR, European symbol
RASPPBERRY_PI = pinhead:PINHD-2X20: PIN HEADER
RPI = RPI-Zero:RPI-ZERO
S1 = switch:SWITCH_LPV-1: TOGGLE SWITCH; RS: 734-7306
S2 S3 = switch:TL36PO: TINY SWITCH ON - ON Source: http://www2.produktinfo.conrad.com/datenblaetter/700000-724999/705152-da-01-de-Subminiaturschalter_TL_36YO.pdf; RS: 913-9069
T1 T3 T11-T24 = transistor:*-NPN-: NPN Transistror BF959 corrected 2008.03.06; RS: 781-4272
T2 T4-T10 = transistor:*-NPN-: NPN Transistror BF959 corrected 2008.03.06
TOF_PINCE = con-jst:JST-06
U1 = Teensy_libSG:TEENSY_3.5_DIL+USB
U2 = Teensy_libSG:TEENSY_3.1-3.2_DIL: Teensy 3.1 or 3.2 in a DIL Layout.
U$1 = Teensy_libSG:TEENSY_3.1-3.2_DIL+4: Teensy 3.1 and 3.2 in a DIL package with the inner 4 pins
U$2 U$4 = push-button:PUSH-BUTTON; RS: 479-1491
U$3 = WIZnet:WIZ820IO
USB_BACKUP_DEBUG = pinhead:PINHD-1X3: PIN HEADER

## Module H-BRIDGE
Ports: +5V(pwr) +12V(pwr) GND(pwr) ENABLE(io) INPUT1(io) INPUT2(io) OUT-(io) OUT+(io)
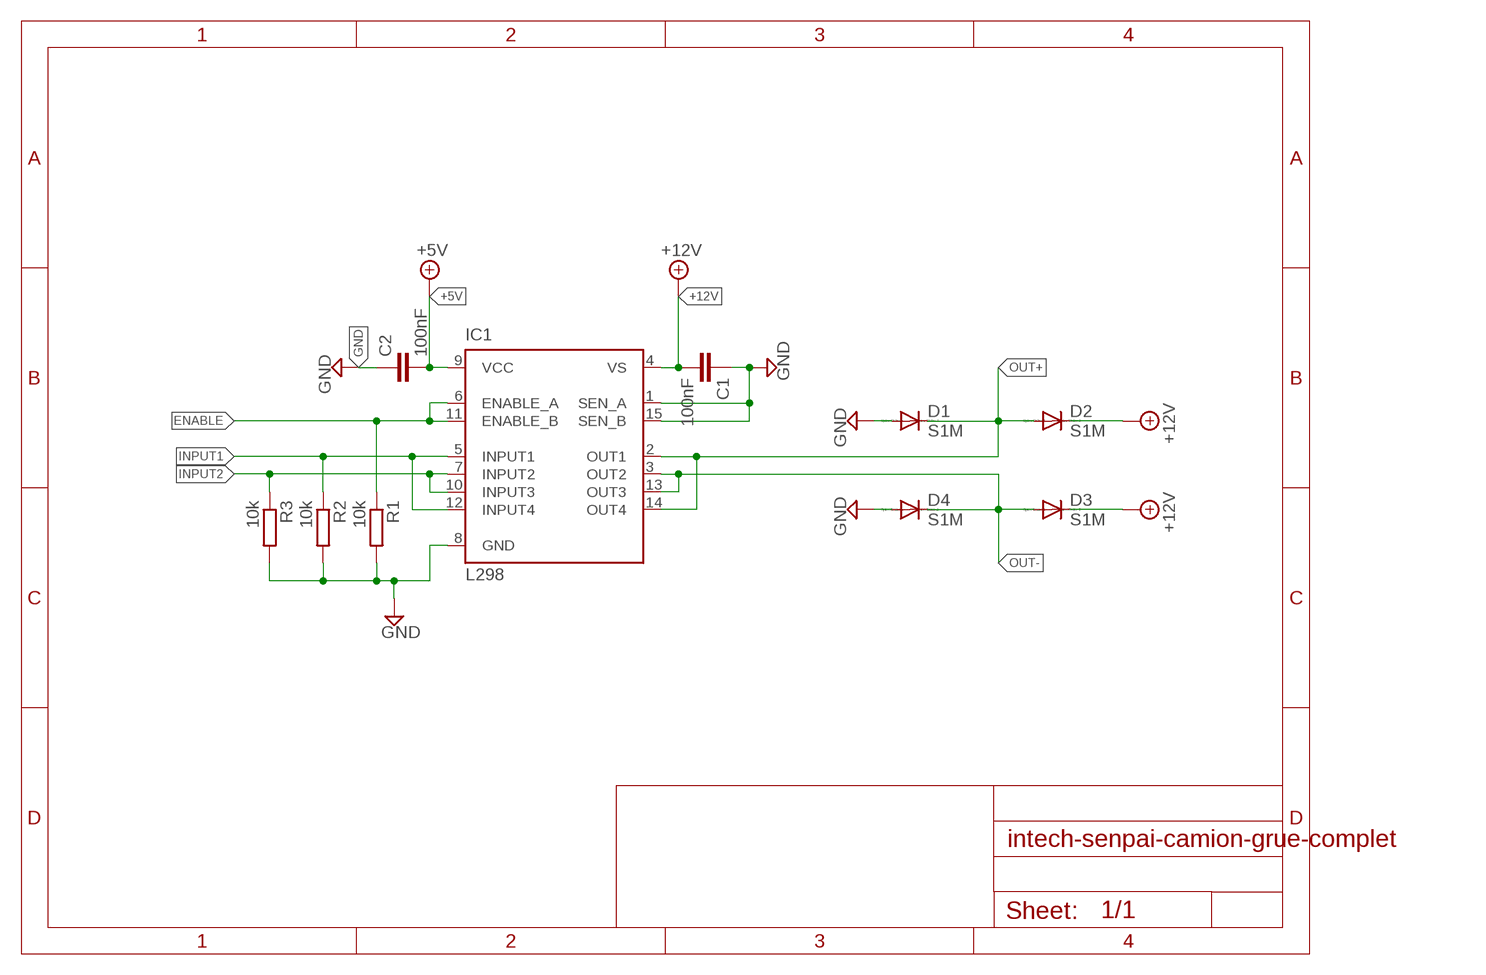
[diagram p4: schematic, module H-BRIDGE, sheet 1]

### Parts
C1  100nF  C-EUC0805  [C0805]
C2  100nF  C-EUC0805  [C0805]
D1  S1M  [SMA]
D2  S1M  [SMA]
D3  S1M  [SMA]
D4  S1M  [SMA]
IC1  L298  [MULTIWATT-15]
R1  10k  R-EU_R0805  [R0805]
R2  10k  R-EU_R0805  [R0805]
R3  10k  R-EU_R0805  [R0805]

### Nets
+5V: C2.2 IC1.9(VCC)
+12V: C1.2 D2.C D3.C IC1.4(VS)
ENABLE: IC1.6(ENABLE_A) IC1.11(ENABLE_B) R1.1
GND: C1.1 C2.1 D1.A D4.A IC1.1(SEN_A) IC1.8(GND) IC1.15(SEN_B) R1.2 R2.2 R3.2
INPUT1: IC1.5(INPUT1) IC1.12(INPUT4) R2.1
INPUT2: IC1.7(INPUT2) IC1.10(INPUT3) R3.1
OUT+: D1.C D2.A IC1.2(OUT1) IC1.14(OUT4)
OUT-: D3.A D4.C IC1.3(OUT2) IC1.13(OUT3)

### Library data of the parts
C1 C2 = resistor:C-EU: CAPACITOR, European symbol
D1-D4 = diode:S1M; RS: 872-2874
IC1 = st-microelectronics:L298: DUAL FULL-BRIDGE DRIVER; MPN: L298N; OC_FARNELL: 1589425; OC_NEWARK: 32M1527
R1-R3 = resistor:R-EU_: RESISTOR, European symbol

## Module H-BRIDGE$A
Ports: ENABLE_A(io) ENABLE_B(io) INPUT1(io) INPUT2(io) INPUT3(io) INPUT4(io) GND(pwr) +5V(pwr) +12V(pwr) OUT1(io) OUT2(io) OUT3(io) OUT4(io)
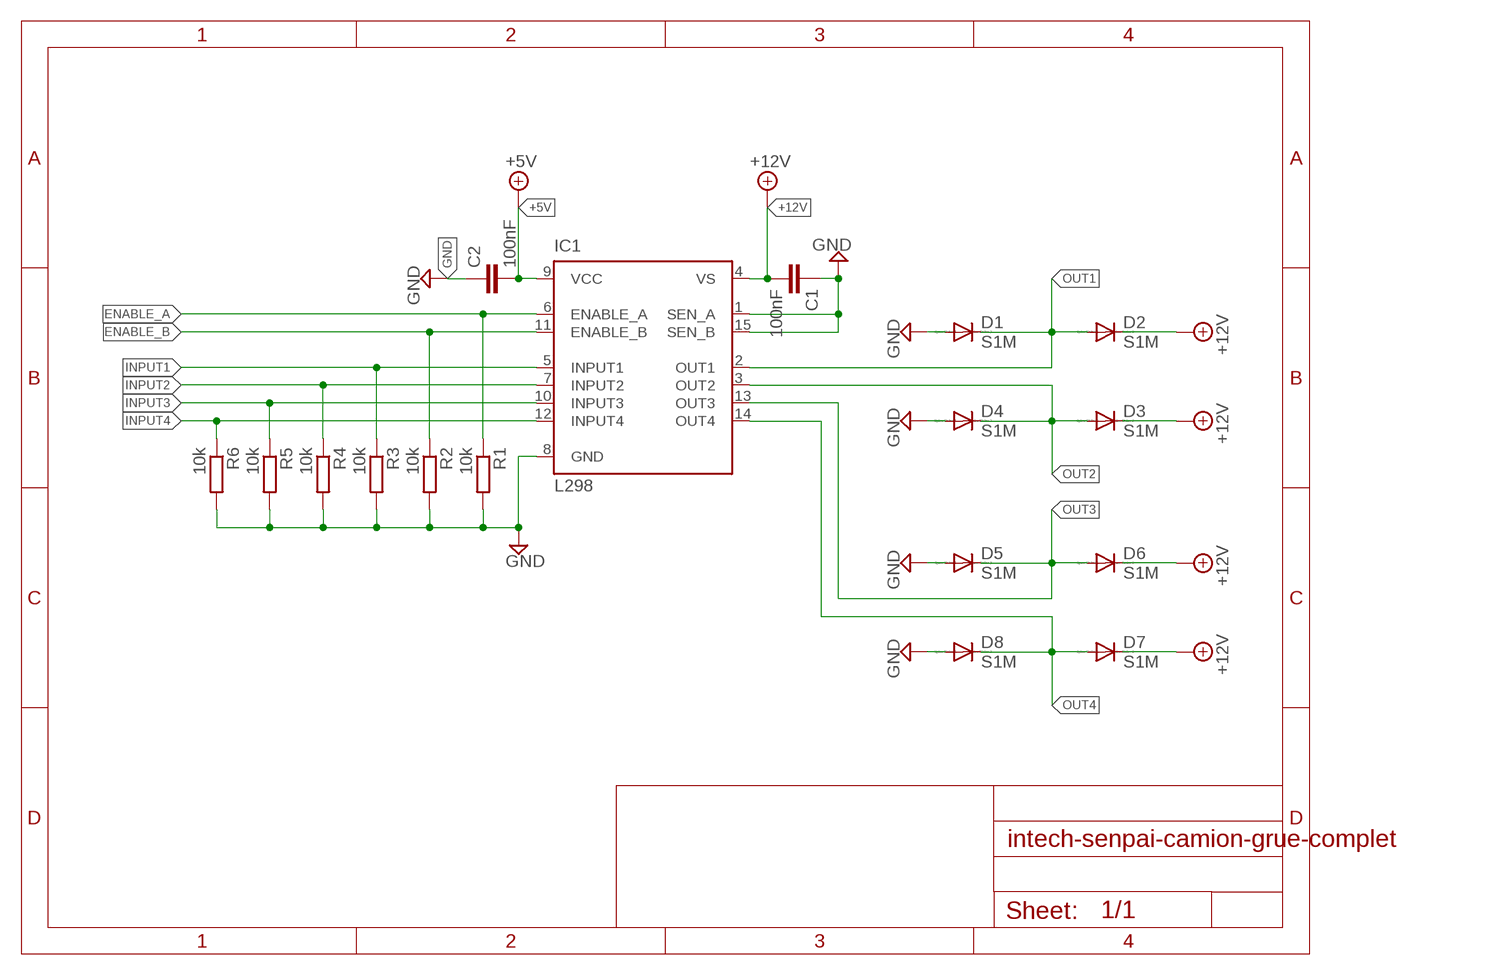
[diagram p5: schematic, module H-BRIDGE$A, sheet 1]

### Parts
C1  100nF  C-EUC0805  [C0805]
C2  100nF  C-EUC0805  [C0805]
D1  S1M  [SMA]
D2  S1M  [SMA]
D3  S1M  [SMA]
D4  S1M  [SMA]
D5  S1M  [SMA]
D6  S1M  [SMA]
D7  S1M  [SMA]
D8  S1M  [SMA]
IC1  L298  [MULTIWATT-15]
R1  10k  R-EU_R0805  [R0805]
R2  10k  R-EU_R0805  [R0805]
R3  10k  R-EU_R0805  [R0805]
R4  10k  R-EU_R0805  [R0805]
R5  10k  R-EU_R0805  [R0805]
R6  10k  R-EU_R0805  [R0805]

### Nets
+5V: C2.2 IC1.9(VCC)
+12V: C1.2 D2.C D3.C D6.C D7.C IC1.4(VS)
ENABLE_A: IC1.6(ENABLE_A) R1.1
ENABLE_B: IC1.11(ENABLE_B) R2.1
GND: C1.1 C2.1 D1.A D4.A D5.A D8.A IC1.1(SEN_A) IC1.8(GND) IC1.15(SEN_B) R1.2 R2.2 R3.2 R4.2 R5.2 R6.2
INPUT1: IC1.5(INPUT1) R3.1
INPUT2: IC1.7(INPUT2) R4.1
INPUT3: IC1.10(INPUT3) R5.1
INPUT4: IC1.12(INPUT4) R6.1
OUT1: D1.C D2.A IC1.2(OUT1)
OUT2: D3.A D4.C IC1.3(OUT2)
OUT3: D5.C D6.A IC1.13(OUT3)
OUT4: D7.A D8.C IC1.14(OUT4)

### Library data of the parts
C1 C2 = resistor:C-EU: CAPACITOR, European symbol
D1-D8 = diode:S1M; RS: 872-2874
IC1 = st-microelectronics:L298: DUAL FULL-BRIDGE DRIVER; MPN: L298N; OC_FARNELL: 1589425; OC_NEWARK: 32M1527
R1-R6 = resistor:R-EU_: RESISTOR, European symbol

## Module MULTI-BUTTON-ON-ADC
Ports: ADC(io) LOGIC_HIGH(io) LOGIC_LOW(io)
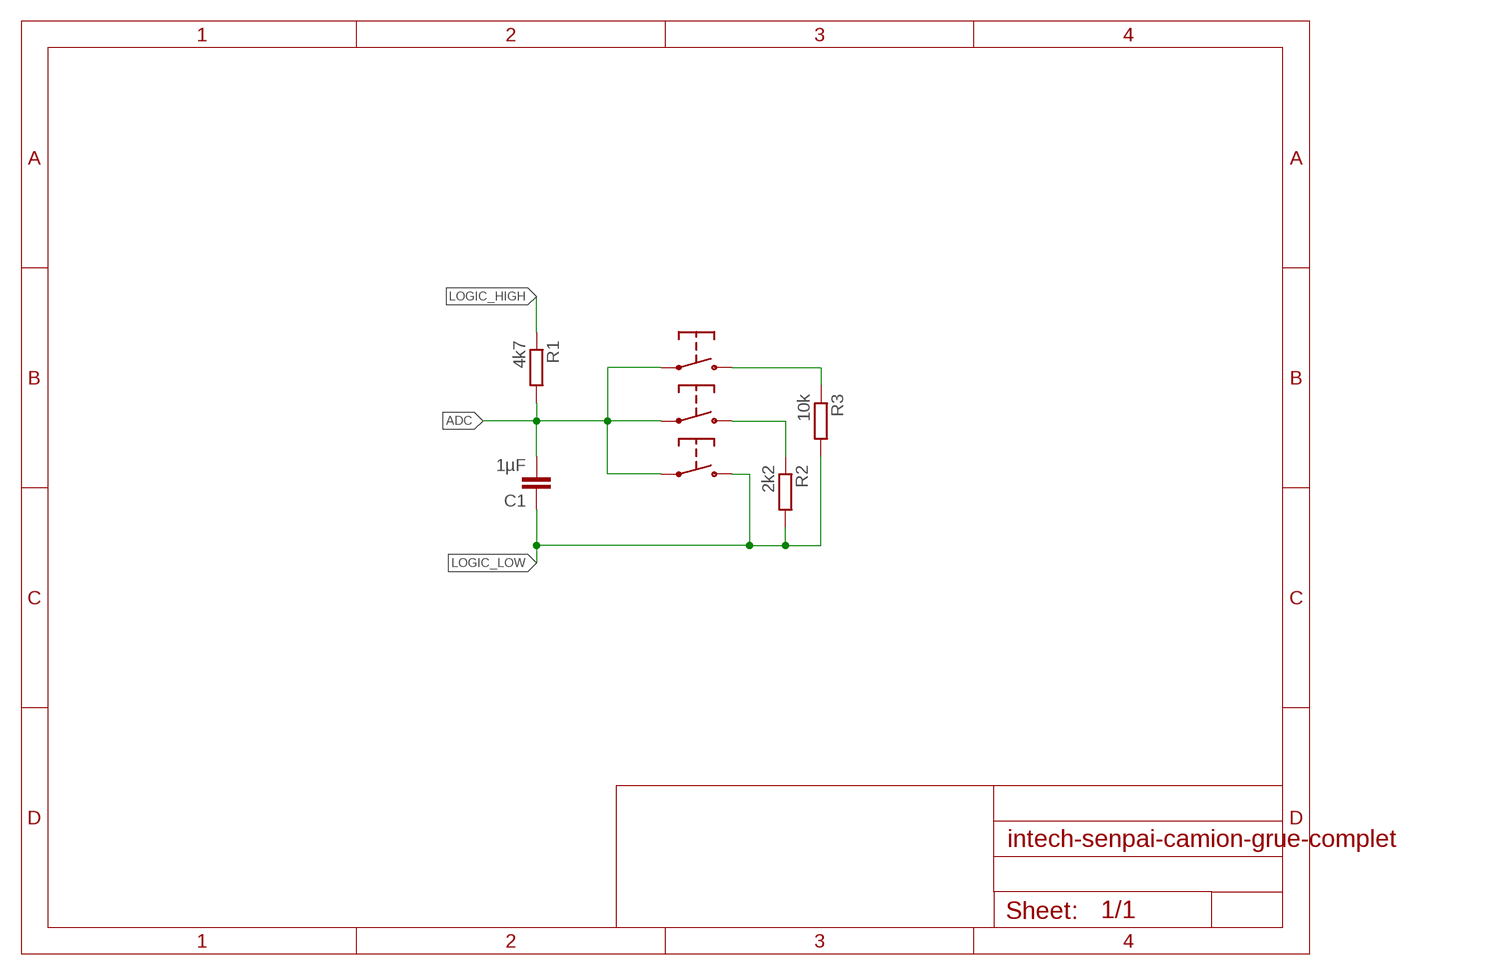
[diagram p6: schematic, module MULTI-BUTTON-ON-ADC, sheet 1]

### Parts
C1  1µF  C-EUC0805  [C0805]
R1  4k7  R-EU_R0805  [R0805]
R2  2k2  R-EU_R0805  [R0805]
R3  10k  R-EU_R0805  [R0805]
U1  PUSH-BUTTON  [PUSH-BUTTON]
U2  PUSH-BUTTON  [PUSH-BUTTON]
U3  PUSH-BUTTON  [PUSH-BUTTON]

### Nets
ADC: C1.2 R1.2 U1.1 U1.2 U2.1 U2.2 U3.1 U3.2
LOGIC_HIGH: R1.1
LOGIC_LOW: C1.1 R2.2 R3.2 U3.3 U3.4
N$3: R2.1 U2.3 U2.4
N$4: R3.1 U1.3 U1.4

### Library data of the parts
C1 = resistor:C-EU: CAPACITOR, European symbol
R1-R3 = resistor:R-EU_: RESISTOR, European symbol
U1-U3 = push-button:PUSH-BUTTON; H: 4.3mm; RS: 479-1491